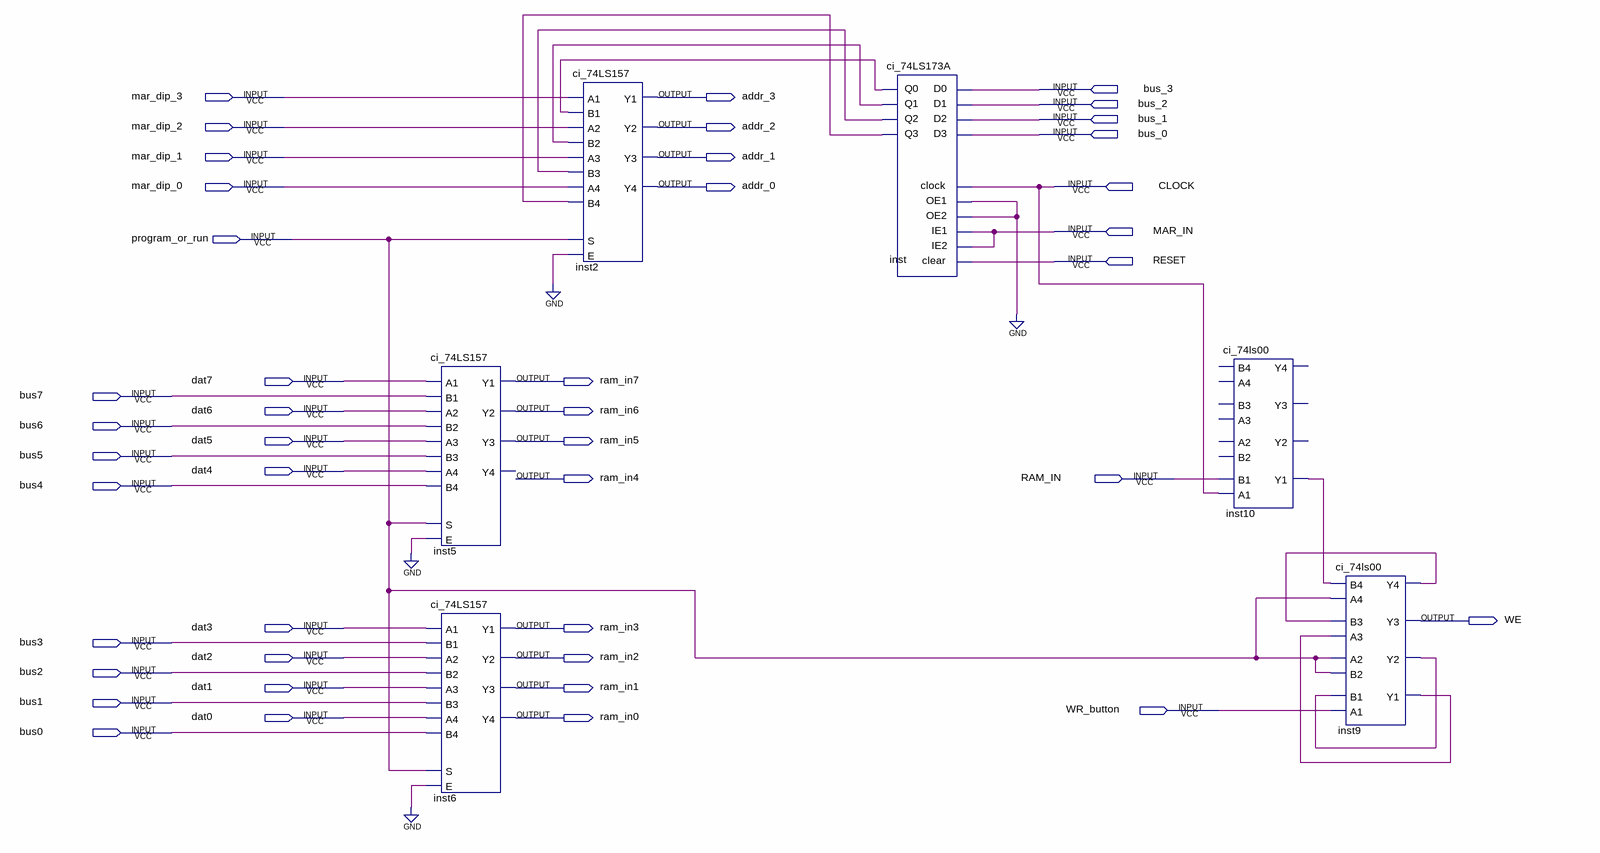
[diagram p0: schematic sheet]
// Quartus schematic cp_mar.bdf as structural Verilog: 6 symbols, 43 pins
module cp_mar (
  input  bus_3,
  input  mar_dip_3,
  input  bus_2,
  input  bus_1,
  input  mar_dip_2,
  input  bus_0,
  input  mar_dip_1,
  input  mar_dip_0,
  input  CLOCK,
  input  MAR_IN,
  input  program_or_run,
  input  RESET,
  input  dat7,
  input  bus7,
  input  dat6,
  input  bus6,
  input  dat5,
  input  bus5,
  input  dat4,
  input  RAM_IN,
  input  bus4,
  input  dat3,
  input  bus3,
  input  dat2,
  input  bus2,
  input  dat1,
  input  bus1,
  input  WR_button,
  input  dat0,
  input  bus0,
  output addr_3,
  output addr_2,
  output addr_1,
  output addr_0,
  output ram_in7,
  output ram_in6,
  output ram_in5,
  output ram_in4,
  output WE,
  output ram_in3,
  output ram_in2,
  output ram_in1,
  output ram_in0
);

  wire inst9_y1, inst9_y2, inst9_y4, inst10_y1, inst_q0, inst_q1, inst_q2, inst_q3;

  ci_74LS157 inst5 (
    .S(program_or_run), .E(1'b0), .B1(bus7), .A1(dat7), .B2(bus6), .A2(dat6), .B3(bus5), .A3(dat5),
    .B4(bus4), .A4(dat4), .Y1(ram_in7), .Y2(ram_in6), .Y3(ram_in5));  // open: Y4
  ci_74LS157 inst6 (
    .S(program_or_run), .E(1'b0), .B1(bus3), .A1(dat3), .B2(bus2), .A2(dat2), .B3(bus1), .A3(dat1),
    .B4(bus0), .A4(dat0), .Y1(ram_in3), .Y2(ram_in2), .Y3(ram_in1), .Y4(ram_in0));
  ci_74LS157 inst2 (
    .S(program_or_run), .E(1'b0), .B1(inst_q0), .A1(mar_dip_3), .B2(inst_q1), .A2(mar_dip_2), .B3(inst_q2),
    .A3(mar_dip_1), .B4(inst_q3), .A4(mar_dip_0), .Y1(addr_3), .Y2(addr_2), .Y3(addr_1), .Y4(addr_0));
  ci_74LS173A inst (
    .D0(bus_3), .D1(bus_2), .D2(bus_1), .D3(bus_0), .IE1(MAR_IN), .IE2(MAR_IN), .clock(CLOCK), .clear(RESET),
    .OE1(1'b0), .OE2(1'b0), .Q0(inst_q0), .Q1(inst_q1), .Q2(inst_q2), .Q3(inst_q3));
  ci_74ls00 inst10 (.A1(CLOCK), .B1(RAM_IN), .Y1(inst10_y1));  // open: B4, A4, B3, A3, A2, B2, Y4, Y3, Y2
  ci_74ls00 inst9 (
    .B4(inst10_y1), .A4(program_or_run), .B3(inst9_y4), .A3(inst9_y1), .A1(WR_button), .B1(inst9_y2),
    .A2(program_or_run), .B2(program_or_run), .Y4(inst9_y4), .Y3(WE), .Y1(inst9_y1), .Y2(inst9_y2));
endmodule
